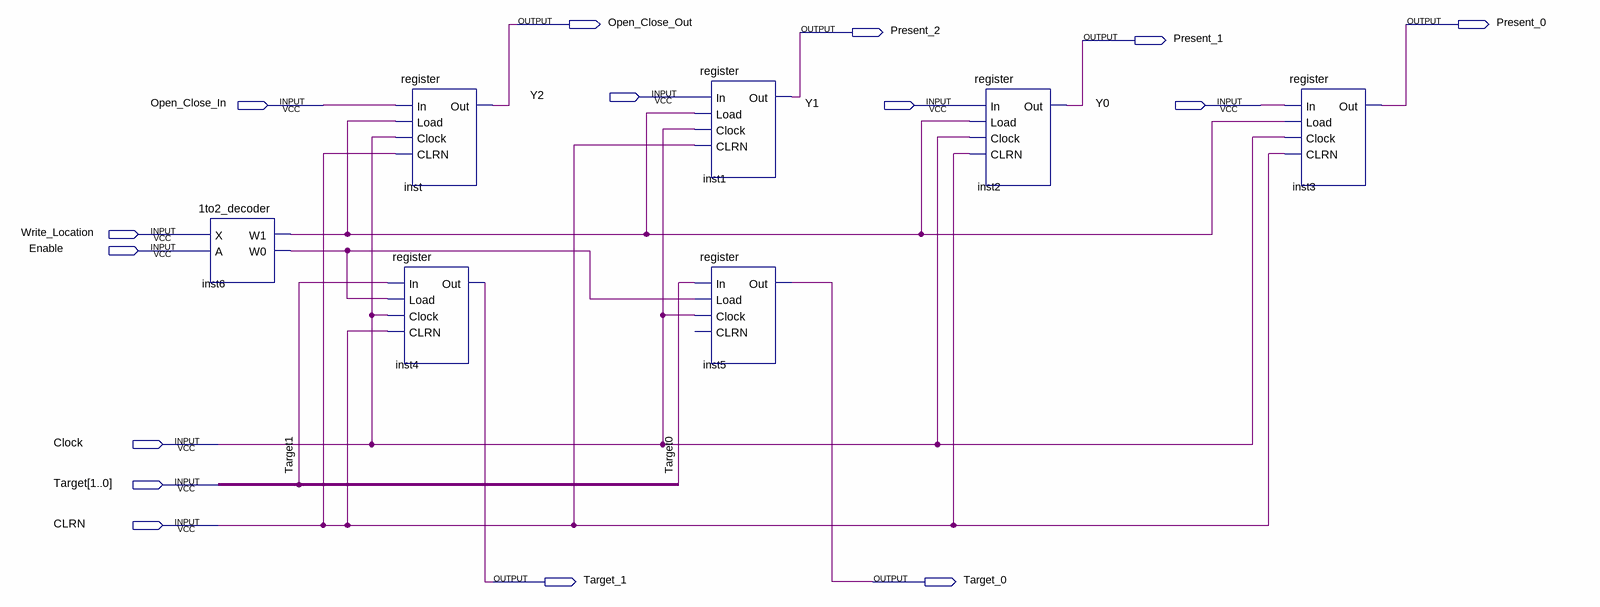
[diagram p0: schematic sheet]
// Quartus schematic RegFile.bdf as structural Verilog: 7 symbols, 15 pins
module RegFile (
  input  Y2,
  input  Open_Close_In,
  input  Y1,
  input  Y0,
  input  Write_Location,
  input  Enable,
  input  Clock,
  input  [1:0] Target,
  input  CLRN,
  output Open_Close_Out,
  output Present_0,
  output Present_2,
  output Present_1,
  output Target_1,
  output Target_0
);

  wire inst6_w0, inst6_w1;

  \1to2_decoder  inst6 (.X(Write_Location), .A(Enable), .W1(inst6_w1), .W0(inst6_w0));
  register inst (.In(Open_Close_In), .Load(inst6_w1), .Clock(Clock), .CLRN(CLRN), .Out(Open_Close_Out));
  register inst4 (.In(Target[1]), .Load(inst6_w0), .Clock(Clock), .CLRN(CLRN), .Out(Target_1));
  register inst1 (.In(Y2), .Load(inst6_w1), .Clock(Clock), .CLRN(CLRN), .Out(Present_2));
  register inst5 (.In(Target[0]), .Load(inst6_w0), .Clock(Clock), .Out(Target_0));  // open: CLRN
  register inst2 (.In(Y1), .Load(inst6_w1), .Clock(Clock), .CLRN(CLRN), .Out(Present_1));
  register inst3 (.In(Y0), .Load(inst6_w1), .Clock(Clock), .CLRN(CLRN), .Out(Present_0));
endmodule
